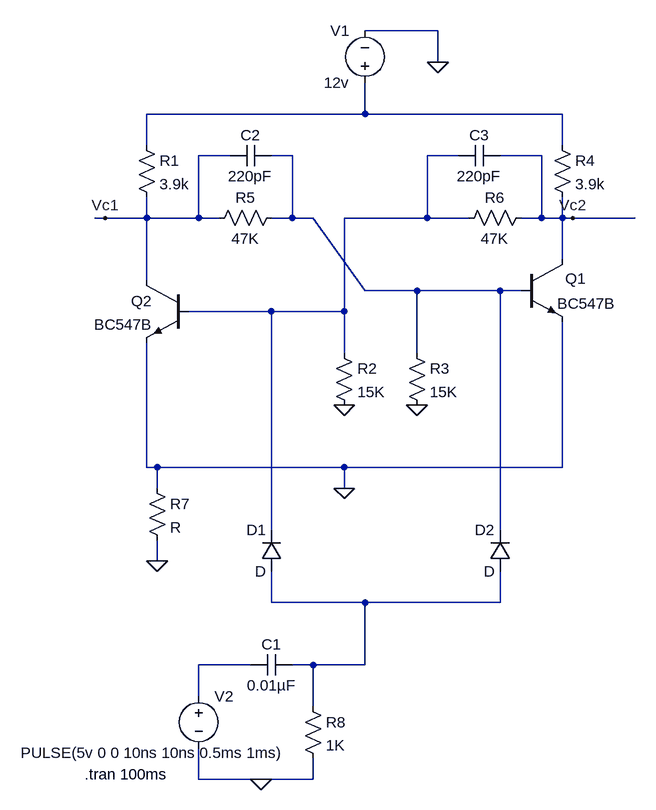
[diagram p0: schematic bistable.asc]
bistable.asc, the LTspice schematic file:
Version 4
SHEET 1 880 964
WIRE 320 -208 208 -208
WIRE 320 -160 320 -208
WIRE 208 -80 208 -128
WIRE 208 -80 -128 -80
WIRE 512 -80 208 -80
WIRE -128 -32 -128 -80
WIRE 512 -32 512 -80
WIRE 0 -16 -48 -16
WIRE 96 -16 64 -16
WIRE 352 -16 304 -16
WIRE 480 -16 416 -16
WIRE -192 80 -208 80
WIRE -128 80 -128 48
WIRE -128 80 -192 80
WIRE -48 80 -48 -16
WIRE -48 80 -128 80
WIRE -16 80 -48 80
WIRE 96 80 96 -16
WIRE 96 80 64 80
WIRE 128 80 96 80
WIRE 304 80 304 -16
WIRE 304 80 176 80
WIRE 368 80 304 80
WIRE 480 80 480 -16
WIRE 480 80 448 80
WIRE 512 80 512 48
WIRE 512 80 480 80
WIRE 528 80 512 80
WIRE 624 80 528 80
WIRE 512 144 512 80
WIRE -128 176 -128 80
WIRE 208 192 128 80
WIRE 288 192 208 192
WIRE 416 192 288 192
WIRE 448 192 416 192
WIRE 64 224 -64 224
WIRE 176 224 176 80
WIRE 176 224 64 224
WIRE 176 288 176 224
WIRE 288 288 288 192
WIRE -128 464 -128 272
WIRE -112 464 -128 464
WIRE 176 464 -112 464
WIRE 512 464 512 240
WIRE 512 464 176 464
WIRE -112 496 -112 464
WIRE 176 496 176 464
WIRE 64 560 64 224
WIRE 416 560 416 192
WIRE -112 608 -112 576
WIRE 64 672 64 624
WIRE 208 672 64 672
WIRE 416 672 416 624
WIRE 416 672 208 672
WIRE 32 768 -48 768
WIRE 128 768 96 768
WIRE 208 768 208 672
WIRE 208 768 128 768
WIRE -48 816 -48 768
WIRE 128 832 128 768
WIRE -48 944 -48 896
WIRE 48 944 -48 944
WIRE 128 944 128 912
WIRE 128 944 48 944
FLAG 176 496 0
FLAG 528 80 Vc2
FLAG -192 80 Vc1
FLAG 320 -160 0
FLAG 176 368 0
FLAG 288 368 0
FLAG -112 608 0
FLAG 48 944 0
SYMBOL res -144 -48 R0
SYMATTR InstName R1
SYMATTR Value 3.9k
SYMBOL res 496 -48 R0
SYMATTR InstName R4
SYMATTR Value 3.9k
SYMBOL npn 448 144 R0
WINDOW 0 68 29 Left 2
SYMATTR InstName Q1
SYMATTR Value BC547B
SYMBOL npn -64 176 M0
SYMATTR InstName Q2
SYMATTR Value BC547B
SYMBOL voltage 208 -112 R180
WINDOW 0 24 96 Left 2
WINDOW 3 24 16 Left 2
SYMATTR InstName V1
SYMATTR Value 12v
SYMBOL res 80 64 R90
WINDOW 0 0 56 VBottom 2
WINDOW 3 32 56 VTop 2
SYMATTR InstName R5
SYMATTR Value 47K
SYMBOL res 464 64 R90
WINDOW 0 0 56 VBottom 2
WINDOW 3 32 56 VTop 2
SYMATTR InstName R6
SYMATTR Value 47K
SYMBOL res 160 272 R0
SYMATTR InstName R2
SYMATTR Value 15K
SYMBOL res 272 272 R0
SYMATTR InstName R3
SYMATTR Value 15K
SYMBOL diode 80 624 R180
WINDOW 0 24 64 Left 2
WINDOW 3 24 0 Left 2
SYMATTR InstName D1
SYMBOL diode 432 624 R180
WINDOW 0 24 64 Left 2
WINDOW 3 24 0 Left 2
SYMATTR InstName D2
SYMBOL res -128 480 R0
SYMATTR InstName R7
SYMBOL cap 96 752 R90
WINDOW 0 0 32 VBottom 2
WINDOW 3 32 32 VTop 2
SYMATTR InstName C1
SYMATTR Value 0.01µF
SYMBOL res 112 816 R0
SYMATTR InstName R8
SYMATTR Value 1K
SYMBOL voltage -48 800 R0
WINDOW 123 0 0 Left 0
WINDOW 39 0 0 Left 0
WINDOW 3 -274 103 Left 2
SYMATTR InstName V2
SYMATTR Value PULSE(5v 0 0 10ns 10ns 0.5ms 1ms)
SYMBOL cap 64 -32 R90
WINDOW 0 0 32 VBottom 2
WINDOW 3 32 32 VTop 2
SYMATTR InstName C2
SYMATTR Value 220pF
SYMBOL cap 416 -32 R90
WINDOW 0 0 32 VBottom 2
WINDOW 3 32 32 VTop 2
SYMATTR InstName C3
SYMATTR Value 220pF
TEXT -224 936 Left 2 !.tran 100ms

The netlist it stands for:
* bistable.asc
R1 N001 Vc1 3.9k
R4 N001 Vc2 3.9k
Q1 Vc2 N002 0 0 BC547B
Q2 Vc1 N003 0 0 BC547B
V1 N001 0 12v
R5 N002 Vc1 47K
R6 Vc2 N003 47K
R2 N003 0 15K
R3 N002 0 15K
D1 N004 N003 D
D2 N004 N002 D
R7 0 0 R
C1 N004 N005 0.01µF
R8 N004 0 1K
V2 N005 0 PULSE(5v 0 0 10ns 10ns 0.5ms 1ms)
C2 N002 Vc1 220pF
C3 Vc2 N003 220pF
.model D D
.lib standard.dio
.model NPN NPN
.model PNP PNP
.lib standard.bjt
.tran 100ms
.backanno
.end